# Altium schematic sheet [5]Power.SchDoc
size A4; SheetNumber: 5; SheetTotal: 5
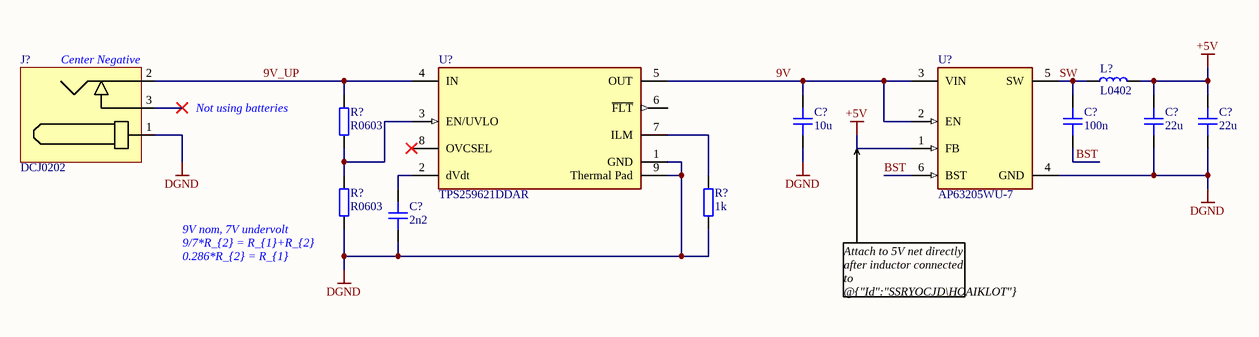
[diagram p0: [5]Power.SchDoc]

## Parts
(Parts that share a designator on the sheet are numbered #1, #2 ... from top to bottom, then left to right.)
C?#1  10u  [CAP_1210]
C?#2  100n  [CAP_0603]
C?#3  22u  [CAP_1210]
C?#4  22u  [CAP_1210]
C?#5  2n2  [CAP_0603]
J?  DCJ0202  [DCJ0202]
L?  L0402  [IND_0402]
R?#1  R0603  [RES_0603]
R?#2  R0603  [RES_0603]
R?#3  1k  [RES_0603]
U?#1  TPS259621DDAR  [FP-DDA0008J-IPC_A]
U?#2  AP63205WU-7  [FP-TSOT26-MFG]

## Nets
+5V: C?#3.2 C?#4.2 L?.2 U?#2.1(FB)
DGND: C?#1.1 C?#3.1 C?#4.1 C?#5.1 J?.1 R?#2.1 R?#3.1 U?#1.1(GND) U?#1.9(Thermal_Pad) U?#2.4(GND)
9V: C?#1.2 U?#1.5(OUT) U?#2.2(EN) U?#2.3(VIN)
9V_UP: J?.2 R?#1.2 U?#1.4(IN)
BST: C?#2.1 U?#2.6(BST)
SW: C?#2.2 L?.1 U?#2.5(SW)
NetC?#5_2: C?#5.2 U?#1.2(dVdt)
NetR?#1_1: R?#1.1 R?#2.2 U?#1.3(EN/UVLO)
NetR?#3_2: R?#3.2 U?#1.7(ILM)

Not connected (* = marked no-connect by the designer): J? 3*; U?#1 6(~{FLT}) 8(OVCSEL)*

## Notes on the sheet
- (near J?) Center Negative
- (near R?#1) Not using batteries
- (near R?#2) 9V nom, 7V undervolt
- (near R?#2) 9/7*R_{2} = R_{1}+R_{2}
- 0.286*R_{2} = R_{1}
- Attach to 5V net directly after inductor connected to @{"Id":"SSRYOCJD\HOAIKLOT"}

## Library data of the parts
C?#1 C?#3 C?#4 = CAP_1210: Capacitor SMD 1210; Manufacturer: *; Manufacturer Part Number: *; Distributor Link: *; LCSC: *; Rating: *; Dielectric: *
C?#2 C?#5 = CAP_0603: Capacitor SMD 0603; Manufacturer: *; Manufacturer Part Number: *; Distributor Link: *; LCSC: *; Rating: *; Dielectric: *
J? = DCJ0202: DC Barrell Jack 2.1mm 24V 5A THT; Manufacturer: CONEC; Manufacturer Part Number: DCJ0202
L? = IND_0402: Inductor SMD 0402
R?#1-R?#3 = RES_0603: Resistor SMD 0603; Manufacturer: *; Manufacturer Part Number: *; Distributor Link: *; LCSC: *
U?#1 = CMP-04910-000076-1: 2.7-19V 130MA-2A SURGE CLAMPING
U?#2 = CMP-12757-000001-1: IC REG BUCK 5V 2A TSOT26; Manufacturer: Diodes Inc.; Max Junction Temp: +160°C; Max Duty Cycle: 100%; Standoff Height: 0.01mm; Max Supply Voltage: 32V; Number Of Outputs: 1; Description: Buck Switching Regulator IC Positive Fixed 5V 1 Output 2A SOT-23-6 Thin, TSOT-23-6; Min Supply Voltage: 3.8V; Output Type: Fixed; Switching Frequency: 1100kHz; Nominal Supply Current: 22uA; Automotive: No; RoHS: TRUE; Switching Topology: Buck; Temperature: -40°C to +85°C; Footprint Url: https://www.diodes.com/assets/Package-Files/TSOT26.pdf; Lead Free: Yes; Digikey Description: IC REG BUCK 5V 2A TSOT26; Device Class L3: Voltage Regulators - Switching; Ambient Temperature Range High: +85°C; Category: IC; Package: TSOT26; Output Voltage: 5V; Output Current: 2A; ComponentLink2Description: Datasheet; Device Class L2: Power Management ICs; Ambient Temperature Range Low: -40°C; Temperature Range High: +85°C; Temperature Range Low: -40°C; Octopart: https://octopart.com/ap63205wu-7-diodes+inc.-98099551; Manufacturer Part Number: AP63205WU-7; Height: 1mm; Device Class L1: Integrated Circuits (ICs); ComponentLink2URL: https://www.diodes.com/assets/Datasheets/AP63200-AP63201-AP63203-AP63205.pdf